# Altium project Motor Controller Modified.PrjPcb
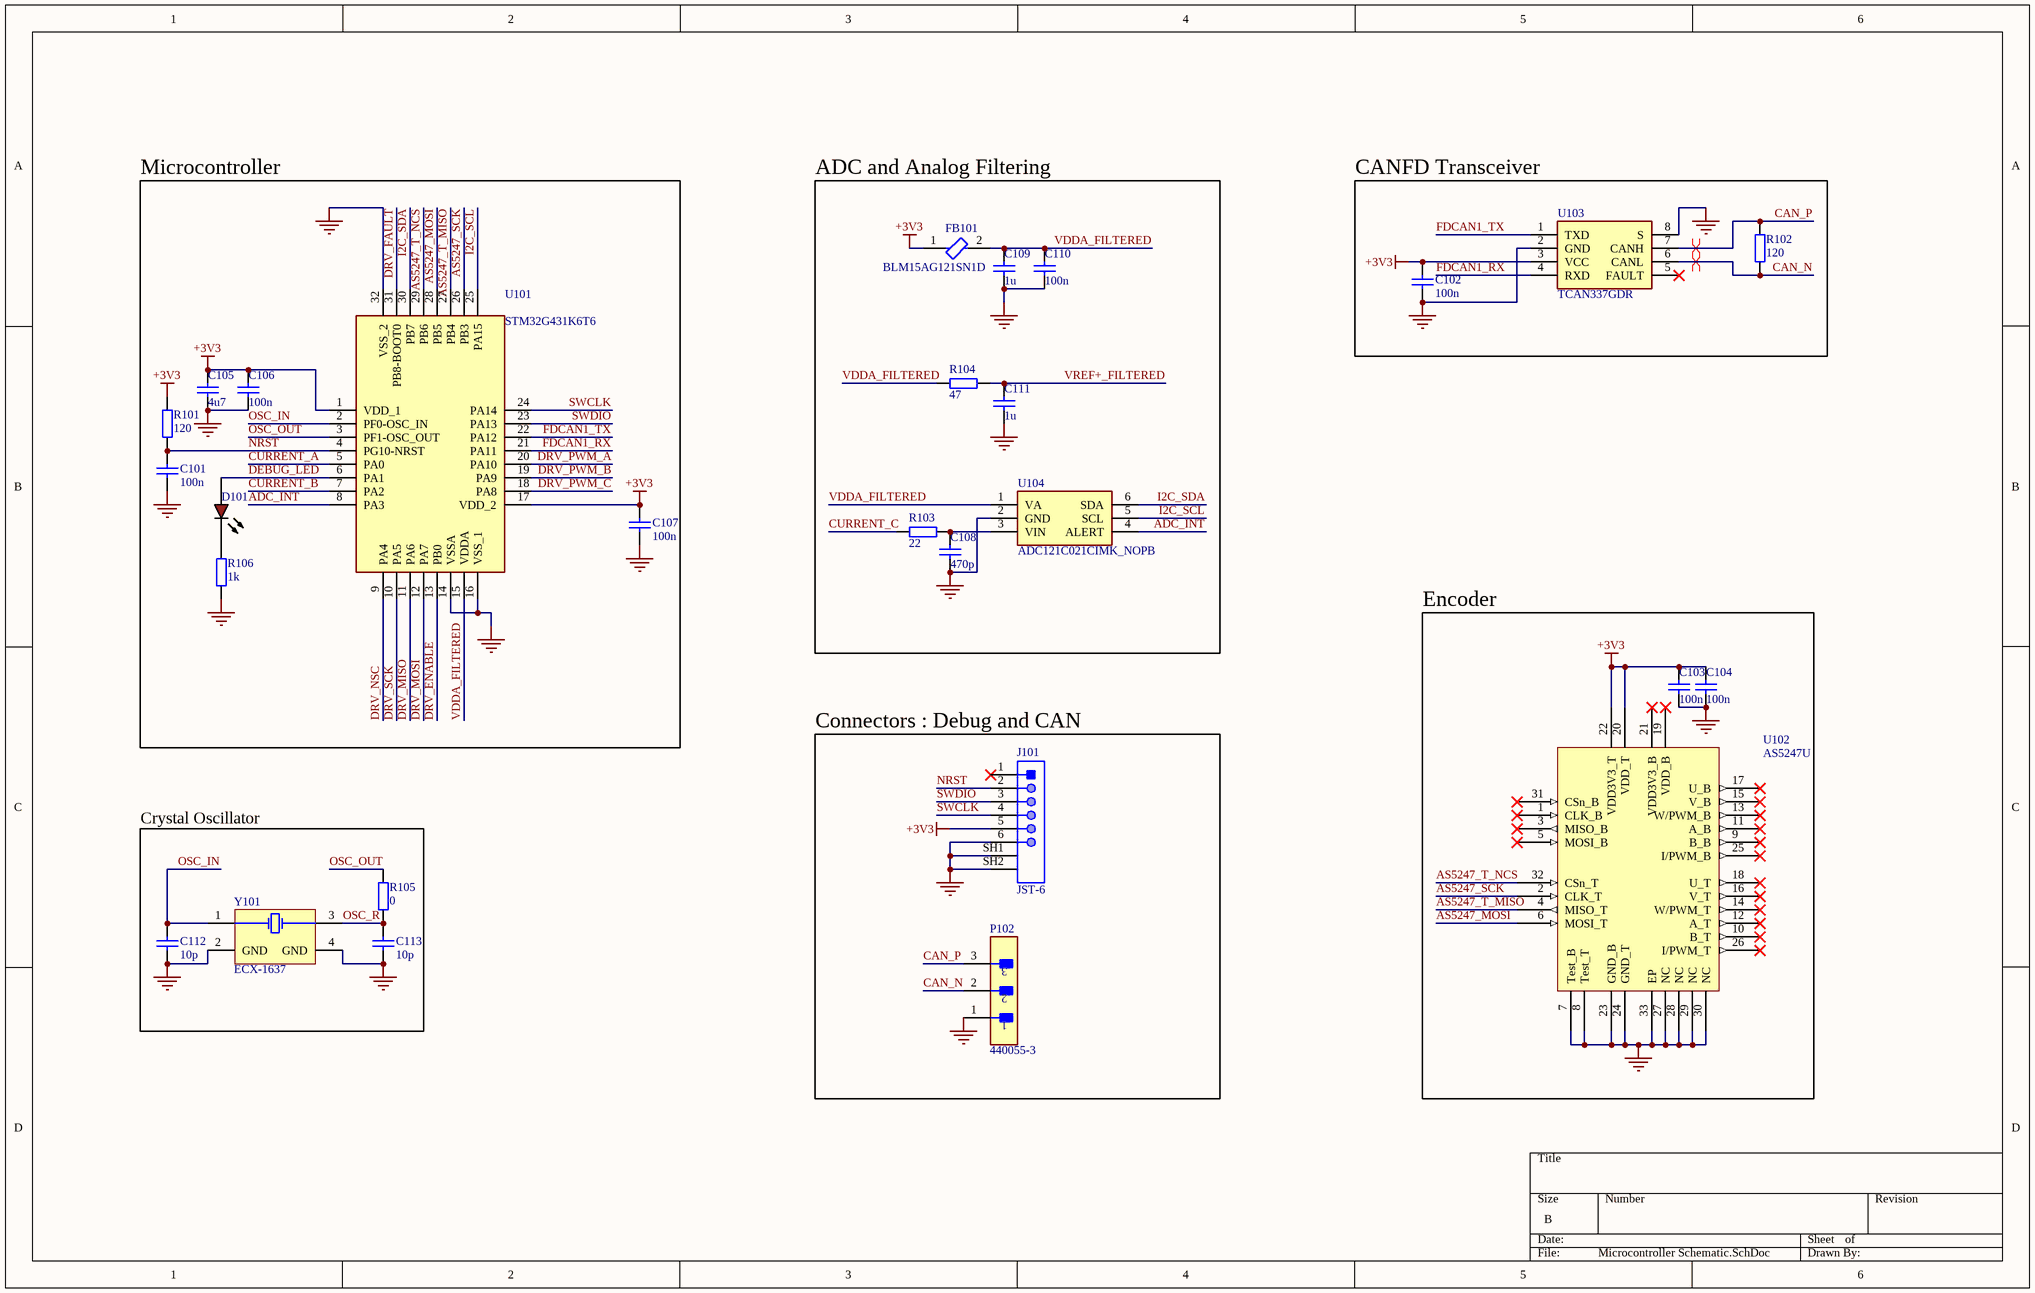
[diagram p0: Microcontroller Schematic.SchDoc]
3 sheets, 80 parts. Net scope: global (net labels, ports and power ports of the same name join across sheets).
Board file: MotorControllerPCB.PcbDoc
Sheets:
  Microcontroller Schematic.SchDoc
  DRV8350R Schematic.SchDoc
  Power.SchDoc

## Sheet Microcontroller Schematic.SchDoc: Microcontroller Schematic
size B; Date: 1/7/2022; Author: Dennis Slobodzian; DrawnBy: Dennis Slobodzian; Engineer: Dennis Slobodzian; Revision: 0.0; SheetNumber: 1; SheetTotal: 3

### Parts
C101  100n  [CAPC1005X55N]
C102  100n  [CAPC1005X55N]
C103  100n  [CAPC1005X55N]
C104  100n  [CAPC1005X55N]
C105  4u7  [CAPC1608X90N]
C106  100n  [CAPC1005X55N]
C107  100n  [CAPC1005X55N]
C108  470p  [CAPC1005X55N]
C109  1u  [CAPC1005X55N]
C110  100n  [CAPC1005X55N]
C111  1u  [CAPC1005X55N]
C112  10p  [CAPC1005X55N]
C113  10p  [CAPC1005X55N]
D101  RED  [150040GS73220]  (value not drawn)
FB101  BLM15AG121SN1D  [FP-BLM15-0_05-MFG]
J101  JST-6  [JST_S6B-ZR-SM4A-TF(LF)(SN)]
P102  440055-3  [FP-440055-3-MFG]
R101  120  [RESC1005X40N]
R102  120  [RESC1005X40N]
R103  22  [RESC1005X40N]
R104  47  [RESC1005X40N]
R105  0  [RESC1005X40N]
R106  1k  [RESC1005X40N]
U101  STM32G431K6T6  [QFP80P900X900X160-32N]
U102  AS5247U  [QFN-N32-THM]
U103  TCAN337GDR  [SOIC127P600X175-8N]
U104  ADC121C021CIMK_NOPB  [SOT95P280X110-6N]
Y101  ECX-1637  [ECX-1637]

### Blocks framed on the sheet
Microcontroller: C101 C105-C107 D101 R101 R106 U101
ADC and Analog Filtering: C108-C111 FB101 R103 R104 U104
CANFD Transceiver: C102 R102 U103
Encoder: C103 C104 U102
Connectors : Debug and CAN: J101 P102
Crystal Oscillator: C112 C113 R105 Y101

### Nets
+3V3: C102.2 C103.2 C104.2 C105.1 C106.2 C107.2 FB101.1 J101.5 R101.1 U101.1(VDD_1) U101.17(VDD_2) U102.20(VDD_T) U102.22(VDD3V3_T) U103.3(VCC)
GND: C101.2 C102.1 C103.1 C104.1 C105.2 C106.1 C107.1 C108.1 C109.1 C110.1 C111.1 C112.1 C113.1 J101.6 J101.SH1 J101.SH2 P102.1 R106.2 U101.14(VSSA) U101.16(VSS_1) U101.32(VSS_2) U102.7(Test_B) U102.8(Test_T) U102.23(GND_B) U102.24(GND_T) U102.27(NC) U102.28(NC) U102.29(NC) U102.30(NC) U102.33(EP) U103.2(GND) U103.8(S) U104.2(GND) Y101.2(GND) Y101.4(GND)
ADC_INT: U101.8(PA3) U104.4(ALERT)
AS5247_MOSI: U101.28(PB5) U102.6(MOSI_T)
AS5247_SCK: U101.26(PB3) U102.2(CLK_T)
AS5247_T_MISO: U101.27(PB4) U102.4(MISO_T)
AS5247_T_NCS: U101.29(PB6) U102.32(CSn_T)
CAN_N: P102.2 R102.1 U103.6(CANL)
CAN_P: P102.3 R102.2 U103.7(CANH)
CURRENT_A: U101.5(PA0)
CURRENT_B: U101.7(PA2)
CURRENT_C: R103.1
DEBUG_LED: D101.1(A) U101.6(PA1)
DRV_ENABLE: U101.13(PB0)
DRV_FAULT: U101.31(PB8-BOOT0)
DRV_MISO: U101.11(PA6)
DRV_MOSI: U101.12(PA7)
DRV_NSC: U101.9(PA4)
DRV_PWM_A: U101.20(PA10)
DRV_PWM_B: U101.19(PA9)
DRV_PWM_C: U101.18(PA8)
DRV_SCK: U101.10(PA5)
FDCAN1_RX: U101.21(PA11) U103.4(RXD)
FDCAN1_TX: U101.22(PA12) U103.1(TXD)
I2C_SCL: U101.25(PA15) U104.5(SCL)
I2C_SDA: U101.30(PB7) U104.6(SDA)
NRST: C101.1 J101.2 R101.2 U101.4(PG10-NRST)
OSC_IN: C112.2 U101.2(PF0-OSC_IN) Y101.1(X1)
OSC_OUT: R105.1 U101.3(PF1-OSC_OUT)
OSC_R: C113.2 R105.2 Y101.3(X2)
SWCLK: J101.4 U101.24(PA14)
SWDIO: J101.3 U101.23(PA13)
VDDA_FILTERED: C109.2 C110.2 FB101.2 R104.1 U101.15(VDDA) U104.1(VA)
VREF+_FILTERED: C111.2 R104.2
NetC108_2: C108.2 R103.2 U104.3(VIN)
NetD101_2: D101.2(K) R106.1

Not connected (* = marked no-connect by the designer): J101 1*; U102 1(CLK_B)* 3(MISO_B)* 5(MOSI_B)* 9(B_B)* 10(B_T)* 11(A_B)* 12(A_T)* 13(W/PWM_B)* 14(W/PWM_T)* 15(V_B)* 16(V_T)* 17(U_B)* 18(U_T)* 19(VDD_B)* 21(VDD3V3_B)* 25(I/PWM_B)* 26(I/PWM_T)* 31(CSn_B)*; U103 5(FAULT)*

### Layout directives
differential pair: CAN_N, CAN_P

### Library data of the parts
C101-C104 C106-C113 = CAP_0402_16V: Capacitor; Manufacturer_Name: Samsung Electro-Mechanics; Manufacturer_Part_Number: CL05B104KO5NNNC; Datasheet Link: https://datasheet.datasheetarchive.com/originals/distributors/Datasheets-DGA10/2408147.pdf; Height: 0.55mm; Mouser Part Number: 187-CL05B104KO5NNNC; Mouser Price/Stock: https://www.mouser.co.uk/ProductDetail/Samsung-Electro-Mechanics/CL05B104KO5NNNC?qs=hqM3L16%252BxlfT2SKOuAUq6Q%3D%3D; Arrow Part Number: CL05B104KO5NNNC; Arrow Price/Stock: https://www.arrow.com/en/products/cl05b104ko5nnnc/samsung-electro-mechanics
C105 = CAP_0603_16V: Capacitor; Manufacturer_Name: Samsung Electro-Mechanics; Manufacturer_Part_Number: CL05B104KO5NNNC; Datasheet Link: https://datasheet.datasheetarchive.com/originals/distributors/Datasheets-DGA10/2408147.pdf; Height: 0.55mm; Mouser Part Number: 187-CL05B104KO5NNNC; Mouser Price/Stock: https://www.mouser.co.uk/ProductDetail/Samsung-Electro-Mechanics/CL05B104KO5NNNC?qs=hqM3L16%252BxlfT2SKOuAUq6Q%3D%3D; Arrow Part Number: CL05B104KO5NNNC; Arrow Price/Stock: https://www.arrow.com/en/products/cl05b104ko5nnnc/samsung-electro-mechanics
D101 = RED_0402_LED
FB101 = CMP-0686-00170-4: Chip Ferrite Bead, 0402, 120Ω @ 100MHz, 0.19Ω, 25%, 550mA; Material: Steel; Max DC Current: 500mA; Shielding: Unshielded; Number of Lines: 1; DC Resistance (DCR): 190mR; Impedance: 120R; Packaging: Tape and Reel; Core Material: Ferrite; Number of Pins: 2; Tolerance: 25%; Case Code (Imperial): 0402; DC Current: 500mA; Termination: SMD/SMT; Height: 0.5mm; REACH SVHC: No SVHC; Max Operating Temperature: 125°C; Case Code (Metric): 1005; Length: 1mm; Test Frequency: 100MHz; Lead Free: Lead Free; Depth: 0.55mm; Max Current Rating: 550mA; Case/Package: 0402; Min Operating Temperature: -55°C; Width: 0.5mm; Military Standard: Not; Frequency: 100MHz; Current Rating: 550mA; Package Quantity: 1; Number of Circuits: 1; Radiation Hardening: No
P102 = CMP-03369-000061-1: CONN HEADER R/A 3POS 2MM; Manufacturer: TE Connectivity; Voltage Rating: 250V; Conn Orientation: Right Angle; Current Rating: 3A; Number Of Contacts: 3; Conn Gender: Male; Height: 5.25mm; Automotive: No; Manufacturer Part Number: 440055-3; Temperature: -25°C to +85°C; Pitch: 2mm; Category: Conn; Device Class L1: Connectors; ComponentLink2Description: Datasheet; Footprint Url: https://www.te.com/commerce/DocumentDelivery/DDEController?Action=showdoc&DocId=Customer+Drawing%7F440055%7FB4%7Fpdf%7FEnglish%7FENG_CD_440055_B4.pdf%7F440055-3; Package: 440055-3; ComponentLink2URL: https://www.te.com/usa-en/product-440055-3.datasheet.pdf; Number Of Rows: 1; Octopart: https://octopart.com/440055-3-te+connectivity-40644627; Mouser Description: Headers & Wire Housings 3 POS HDR R/A 2.0mm; Digikey Description: CONN HEADER R/A 3POS 2MM; Device Class L2: Headers and Wire Housings; Lead Free: Yes; Temperature Range High: +85°C; RoHS: TRUE; Temperature Range Low: -25°C; Contact Material: Tin; Device Class L3: unset
R101-R106 = RES_0402
U102 = AS5247U: ams AS5247U Magnetic Rotary Position Sensor; ComponentLink1Description: New link; ComponentLink1URL: *; ComponentLink2Description: New link 1; ComponentLink2URL: *
U103 = TCAN337GDR: Integrated Circuit; Manufacturer_Name: Texas Instruments; Datasheet Link: http://www.ti.com/lit/gpn/tcan337g; Height: 1.75mm; Manufacturer_Part_Number: TCAN337GDR; Mouser Part Number: 595-TCAN337GDR; Mouser Price/Stock: https://www.mouser.co.uk/ProductDetail/Texas-Instruments/TCAN337GDR?qs=gMfM3zrbS4qJ%252BEWbPaeUtA%3D%3D; Arrow Part Number: TCAN337GDR; Arrow Price/Stock: https://www.arrow.com/en/products/tcan337gdr/texas-instruments?region=nac
U104 = ADC121C021CIMK_NOPB: Integrated Circuit; Manufacturer_Name: Texas Instruments; Manufacturer_Part_Number: ADC121C021CIMK/NOPB; Datasheet Link: http://www.ti.com/lit/ds/symlink/adc121c021.pdf; Height: 1.1mm; Mouser Part Number: 926-AD121C021CIMKNPB; Mouser Price/Stock: https://www.mouser.co.uk/ProductDetail/Texas-Instruments/ADC121C021CIMK-NOPB?qs=7X5t%252BdzoRHCpyBc1ZtMoSA%3D%3D; Arrow Part Number: ADC121C021CIMK/NOPB; Arrow Price/Stock: https://www.arrow.com/en/products/adc121c021cimknopb/texas-instruments

## Sheet DRV8350R Schematic.SchDoc: DRV
size A; SheetNumber: 2; SheetTotal: 3
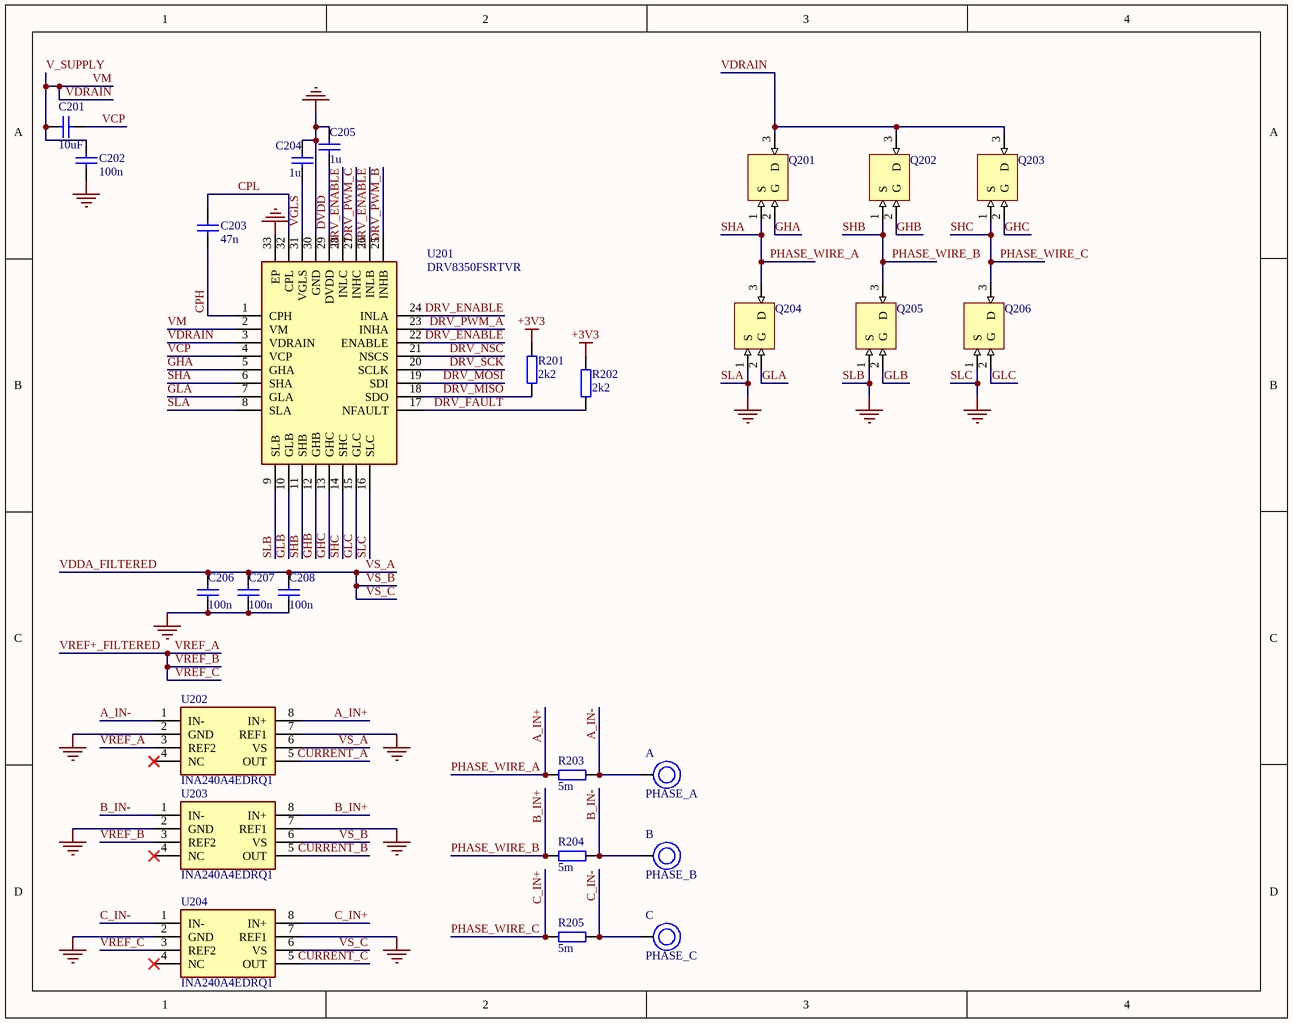
[diagram p1: DRV8350R Schematic.SchDoc]

### Parts
A  PHASE_A  [PAD_HOLE]
B  PHASE_B  [PAD_HOLE]
C  PHASE_C  [PAD_HOLE]
C201  10uF  [CAPC1608X90N]
C202  100n  [CAPC1608X90N]
C203  47n  [CAPC1005X55N]
C204  1u  [CAPC1005X55N]
C205  1u  [CAPC1005X55N]
C206  100n  [CAPC1050X55X23ML05T13]
C207  100n  [CAPC1050X55X23ML05T13]
C208  100n  [CAPC1050X55X23ML05T13]
Q201  NTTFS3D7N06HLTWG  [PQFN-8]  (value not drawn)
Q202  NTTFS3D7N06HLTWG  [PQFN-8]  (value not drawn)
Q203  NTTFS3D7N06HLTWG  [PQFN-8]  (value not drawn)
Q204  NTTFS3D7N06HLTWG  [PQFN-8]  (value not drawn)
Q205  NTTFS3D7N06HLTWG  [PQFN-8]  (value not drawn)
Q206  NTTFS3D7N06HLTWG  [PQFN-8]  (value not drawn)
R201  2k2  [RESC1608X55N]
R202  2k2  [RESC1608X55N]
R203  5m  [RESC3216X80N]
R204  5m  [RESC3216X80N]
R205  5m  [RESC3216X80N]
U201  DRV8350FSRTVR  [WQFN-N32-THM]
U202  INA240A4EDRQ1  [SOIC127P600X175-8N]
U203  INA240A4EDRQ1  [SOIC127P600X175-8N]
U204  INA240A4EDRQ1  [SOIC127P600X175-8N]

### Nets
+3V3: R201.2 R202.2
GND: C202.1 C204.2 C205.1 C206.1 C207.1 C208.1 Q204.1(S) Q205.1(S) Q206.1(S) U201.8(SLA) U201.9(SLB) U201.16(SLC) U201.30(GND) U201.33(EP) U202.2(GND) U202.7(REF1) U203.2(GND) U203.7(REF1) U204.2(GND) U204.7(REF1)  [also labelled SLA, SLB, SLC]
A_IN+: Q201.1(S) Q204.3(D) R203.1 U201.6(SHA) U202.8(IN+)  [also labelled PHASE_WIRE_A, SHA]
A_IN-: A.1 R203.2 U202.1(IN-)
B_IN+: Q202.1(S) Q205.3(D) R204.1 U201.11(SHB) U203.8(IN+)  [also labelled PHASE_WIRE_B, SHB]
B_IN-: B.1 R204.2 U203.1(IN-)
C_IN+: Q203.1(S) Q206.3(D) R205.1 U201.14(SHC) U204.8(IN+)  [also labelled PHASE_WIRE_C, SHC]
C_IN-: C.1 R205.2 U204.1(IN-)
CPH: C203.2 U201.1(CPH)
CPL: C203.1 U201.32(CPL)
CURRENT_A: U202.5(OUT)
CURRENT_B: U203.5(OUT)
CURRENT_C: U204.5(OUT)
DRV_ENABLE: U201.22(ENABLE) U201.24(INLA) U201.26(INLB) U201.28(INLC)
DRV_FAULT: R202.1 U201.17(NFAULT)
DRV_MISO: R201.1 U201.18(SDO)
DRV_MOSI: U201.19(SDI)
DRV_NSC: U201.21(NSCS)
DRV_PWM_A: U201.23(INHA)
DRV_PWM_B: U201.25(INHB)
DRV_PWM_C: U201.27(INHC)
DRV_SCK: U201.20(SCLK)
DVDD: C205.2 U201.29(DVDD)
GHA: Q201.2(G) U201.5(GHA)
GHB: Q202.2(G) U201.12(GHB)
GHC: Q203.2(G) U201.13(GHC)
GLA: Q204.2(G) U201.7(GLA)
GLB: Q205.2(G) U201.10(GLB)
GLC: Q206.2(G) U201.15(GLC)
V_SUPPLY: C201.1 C202.2 Q201.3(D) Q202.3(D) Q203.3(D) U201.2(VM) U201.3(VDRAIN)  [also labelled VDRAIN, VM]
VCP: C201.2 U201.4(VCP)
VDDA_FILTERED: C206.2 C207.2 C208.2 U202.6(VS) U203.6(VS) U204.6(VS)  [also labelled VS_A, VS_B, VS_C]
VGLS: C204.1 U201.31(VGLS)
VREF+_FILTERED: U202.3(REF2) U203.3(REF2) U204.3(REF2)  [also labelled VREF_A, VREF_B, VREF_C]

Not connected (* = marked no-connect by the designer): U202 4(NC)*; U203 4(NC)*; U204 4(NC)*

### Library data of the parts
A B C = 3MM_PAD
C201 = CAP_0805_50V: Capacitor; Manufacturer_Name: Samsung Electro-Mechanics; Manufacturer_Part_Number: CL05B104KO5NNNC; Datasheet Link: https://datasheet.datasheetarchive.com/originals/distributors/Datasheets-DGA10/2408147.pdf; Height: 0.55mm; Mouser Part Number: 187-CL05B104KO5NNNC; Mouser Price/Stock: https://www.mouser.co.uk/ProductDetail/Samsung-Electro-Mechanics/CL05B104KO5NNNC?qs=hqM3L16%252BxlfT2SKOuAUq6Q%3D%3D; Arrow Part Number: CL05B104KO5NNNC; Arrow Price/Stock: https://www.arrow.com/en/products/cl05b104ko5nnnc/samsung-electro-mechanics
C202 = CAP_0603_100V: Capacitor; Manufacturer_Name: Samsung Electro-Mechanics; Manufacturer_Part_Number: CL05B104KO5NNNC; Datasheet Link: https://datasheet.datasheetarchive.com/originals/distributors/Datasheets-DGA10/2408147.pdf; Height: 0.55mm; Mouser Part Number: 187-CL05B104KO5NNNC; Mouser Price/Stock: https://www.mouser.co.uk/ProductDetail/Samsung-Electro-Mechanics/CL05B104KO5NNNC?qs=hqM3L16%252BxlfT2SKOuAUq6Q%3D%3D; Arrow Part Number: CL05B104KO5NNNC; Arrow Price/Stock: https://www.arrow.com/en/products/cl05b104ko5nnnc/samsung-electro-mechanics
C203-C205 = CAP_0402_50V: Capacitor; Manufacturer_Name: Samsung Electro-Mechanics; Manufacturer_Part_Number: CL05B104KO5NNNC; Datasheet Link: https://datasheet.datasheetarchive.com/originals/distributors/Datasheets-DGA10/2408147.pdf; Height: 0.55mm; Mouser Part Number: 187-CL05B104KO5NNNC; Mouser Price/Stock: https://www.mouser.co.uk/ProductDetail/Samsung-Electro-Mechanics/CL05B104KO5NNNC?qs=hqM3L16%252BxlfT2SKOuAUq6Q%3D%3D; Arrow Part Number: CL05B104KO5NNNC; Arrow Price/Stock: https://www.arrow.com/en/products/cl05b104ko5nnnc/samsung-electro-mechanics
C206-C208 = CMP-2000-05439-1: Chip Capacitor, 100 nF, +/- 10%, 16 V, -55 to 125 degC, 0402 (1005 Metric), RoHS, Tape and Reel; Manufacturer: Samsung Electro-Mechanics; Capacitance: 100000pF; Dielectric: X7R; Rated Voltage: 16V; Case Size/Dimension: 0402; Tolerance (%): ±10%; Manufacturer URL: http://www.samsungsem.com/global/index.jsp; Datasheet URL: https://datasheet.ciiva.com/29198/458718-da-01-en-vs-kondensator-0402-29198423.pdf; Datasheet Version: Nov-10
R201 R202 = RES_0603
R203-R205 = RES_1206
U202-U204 = INA240A4EDRQ1: Integrated Circuit; Manufacturer_Name: Texas Instruments; Datasheet Link: http://www.ti.com/lit/ds/symlink/ina240-q1.pdf; Height: 1.75mm; Manufacturer_Part_Number: INA240A4EDRQ1; Mouser Part Number: 595-INA240A4EDRQ1; Mouser Price/Stock: https://www.mouser.co.uk/ProductDetail/Texas-Instruments/INA240A4EDRQ1?qs=yBt6ao%2FxsTymmpZKpOwKvQ%3D%3D; Arrow Part Number: INA240A4EDRQ1; Arrow Price/Stock: https://www.arrow.com/en/products/ina240a4edrq1/texas-instruments

## Sheet Power.SchDoc
size A; SheetNumber: 3; SheetTotal: 3
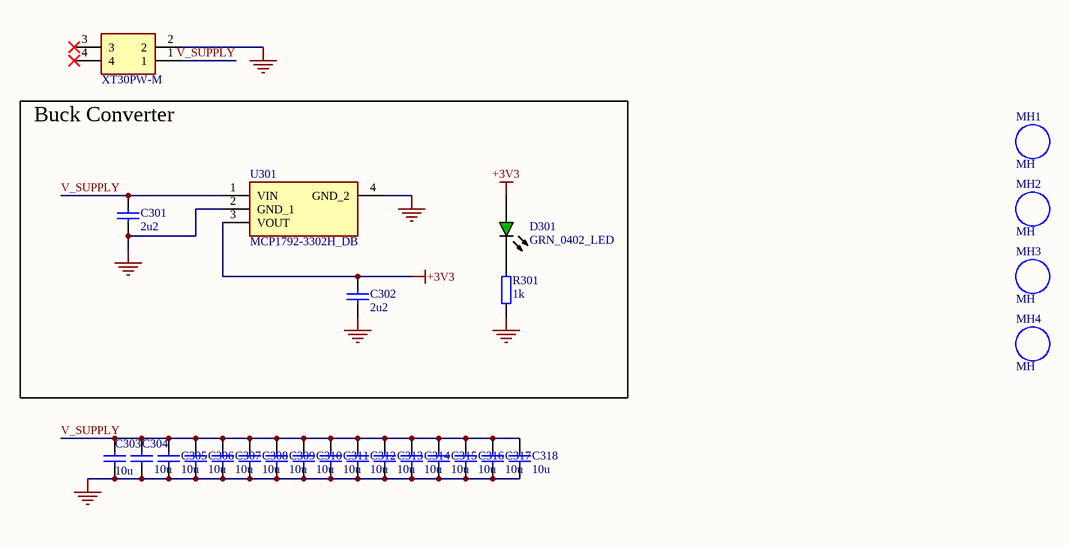
[diagram p2: Power.SchDoc]

### Parts
C301  2u2  [CAPC1608X90N]
C302  2u2  [CAPC1608X90N]
C303  10u  [CAPC1608X90N]
C304  10u  [CAPC1608X90N]
C305  10u  [CAPC1608X90N]
C306  10u  [CAPC1608X90N]
C307  10u  [CAPC1608X90N]
C308  10u  [CAPC1608X90N]
C309  10u  [CAPC1608X90N]
C310  10u  [CAPC1608X90N]
C311  10u  [CAPC1608X90N]
C312  10u  [CAPC1608X90N]
C313  10u  [CAPC1608X90N]
C314  10u  [CAPC1608X90N]
C315  10u  [CAPC1608X90N]
C316  10u  [CAPC1608X90N]
C317  10u  [CAPC1608X90N]
C318  10u  [CAPC1608X90N]
D301  GRN_0402_LED  [150040GS73220]
MH1  MH  [MH]
MH2  MH  [MH]
MH3  MH  [MH]
MH4  MH  [MH]
R301  1k  [RESC1005X40N]
U301  MCP1792-3302H_DB  [SOT230P700X180-4N]
  XT30PW-M  [XT30PWM]

### Blocks framed on the sheet
Buck Converter: C301 C302 D301 R301 U301

### Nets
+3V3: C302.2 D301.1(A) U301.3(VOUT)
GND: C301.1 C302.1 C303.1 C304.1 C305.1 C306.1 C307.1 C308.1 C309.1 C310.1 C311.1 C312.1 C313.1 C314.1 C315.1 C316.1 C317.1 C318.1 R301.2 U301.2(GND_1) U301.4(GND_2) .2
V_SUPPLY: C301.2 C303.2 C304.2 C305.2 C306.2 C307.2 C308.2 C309.2 C310.2 C311.2 C312.2 C313.2 C314.2 C315.2 C316.2 C317.2 C318.2 U301.1(VIN) .1
NetD301_2: D301.2(K) R301.1

Not connected (* = marked no-connect by the designer):  3* 4*

### Library data of the parts
C301 C302 = CAP_0603_50V: Capacitor; Manufacturer_Name: Samsung Electro-Mechanics; Manufacturer_Part_Number: CL05B104KO5NNNC; Datasheet Link: https://datasheet.datasheetarchive.com/originals/distributors/Datasheets-DGA10/2408147.pdf; Height: 0.55mm; Mouser Part Number: 187-CL05B104KO5NNNC; Mouser Price/Stock: https://www.mouser.co.uk/ProductDetail/Samsung-Electro-Mechanics/CL05B104KO5NNNC?qs=hqM3L16%252BxlfT2SKOuAUq6Q%3D%3D; Arrow Part Number: CL05B104KO5NNNC; Arrow Price/Stock: https://www.arrow.com/en/products/cl05b104ko5nnnc/samsung-electro-mechanics
C303-C318 = CAP_0805_50V: as C201 on sheet DRV8350R Schematic; Datasheet Link: https://datasheet.datasheetarchive.com/originals/distributors/Datasheets-DGA10/2408147.pdf; Height: 0.55mm; Mouser Part Number: 187-CL05B104KO5NNNC; Mouser Price/Stock: https://www.mouser.co.uk/ProductDetail/Samsung-Electro-Mechanics/CL05B104KO5NNNC?qs=hqM3L16%252BxlfT2SKOuAUq6Q%3D%3D; Arrow Part Number: CL05B104KO5NNNC; Arrow Price/Stock: https://www.arrow.com/en/products/cl05b104ko5nnnc/samsung-electro-mechanics
R301 = RES_0402
U301 = MCP1792-3302H_DB: Integrated Circuit; Manufacturer_Name: Microchip; Manufacturer_Part_Number: MCP1792-3302H/DB; Datasheet Link: http://ww1.microchip.com/downloads/en/DeviceDoc/MCP1792-Family-Data-Sheet-DS20006229C.pdf; Height: 1.8mm; Mouser Part Number: 579-MCP1792-3302HDB; Mouser Price/Stock: https://www.mouser.co.uk/ProductDetail/Microchip-Technology/MCP1792-3302H-DB?qs=mAH9sUMRCttoG5iLrM6fSg%3D%3D; Arrow Part Number: MCP1792-3302H/DB; Arrow Price/Stock: https://www.arrow.com/en/products/mcp1792-3302hdb/microchip-technology
 = XT30PW-M: Connector; Manufacturer_Name: Amass

## Nets that join several sheets
+3V3: Microcontroller Schematic (14 pins), DRV8350R Schematic (R201.2 R202.2), Power (C302.2 D301.1 U301.3)
GND: Microcontroller Schematic (35 pins), DRV8350R Schematic (20 pins), Power (22 pins)
CURRENT_A: Microcontroller Schematic (U101.5), DRV8350R Schematic (U202.5)
CURRENT_B: Microcontroller Schematic (U101.7), DRV8350R Schematic (U203.5)
CURRENT_C: Microcontroller Schematic (R103.1), DRV8350R Schematic (U204.5)
DRV_ENABLE: Microcontroller Schematic (U101.13), DRV8350R Schematic (U201.22 U201.24 U201.26 U201.28)
DRV_FAULT: Microcontroller Schematic (U101.31), DRV8350R Schematic (R202.1 U201.17)
DRV_MISO: Microcontroller Schematic (U101.11), DRV8350R Schematic (R201.1 U201.18)
DRV_MOSI: Microcontroller Schematic (U101.12), DRV8350R Schematic (U201.19)
DRV_NSC: Microcontroller Schematic (U101.9), DRV8350R Schematic (U201.21)
DRV_PWM_A: Microcontroller Schematic (U101.20), DRV8350R Schematic (U201.23)
DRV_PWM_B: Microcontroller Schematic (U101.19), DRV8350R Schematic (U201.25)
DRV_PWM_C: Microcontroller Schematic (U101.18), DRV8350R Schematic (U201.27)
DRV_SCK: Microcontroller Schematic (U101.10), DRV8350R Schematic (U201.20)
V_SUPPLY: DRV8350R Schematic (7 pins), Power (19 pins)
VDDA_FILTERED: Microcontroller Schematic (6 pins), DRV8350R Schematic (6 pins)
VREF+_FILTERED: Microcontroller Schematic (C111.2 R104.2), DRV8350R Schematic (U202.3 U203.3 U204.3)